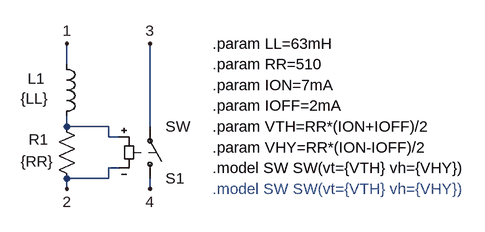
[diagram p0: schematic relais.asc]
relais.asc, the LTspice schematic file:
Version 4
SHEET 1 880 680
WIRE 176 80 176 48
WIRE 176 176 176 160
WIRE 240 176 176 176
WIRE 304 176 304 48
WIRE 240 192 240 176
WIRE 256 192 240 192
WIRE 256 240 240 240
WIRE 240 256 240 240
WIRE 240 256 176 256
WIRE 176 272 176 256
WIRE 304 272 304 256
FLAG 176 48 1
FLAG 176 272 2
FLAG 304 48 3
FLAG 304 272 4
SYMBOL ind 160 64 R0
WINDOW 0 -44 38 Left 2
WINDOW 3 -55 69 Left 2
SYMATTR InstName L1
SYMATTR Value {LL}
SYMATTR SpiceLine Ipk=20m Rser=0 Rpar=100Meg Cpar=0
SYMBOL res 160 160 R0
WINDOW 0 -43 36 Left 2
WINDOW 3 -55 70 Left 2
SYMATTR InstName R1
SYMATTR Value {RR}
SYMBOL sw 304 272 M180
SYMATTR InstName S1
TEXT 400 48 Left 2 !.param LL=63mH
TEXT 400 80 Left 2 !.param RR=510
TEXT 400 112 Left 2 !.param ION=7mA\n.param IOFF=2mA
TEXT 400 176 Left 2 !.param VTH=RR*(ION+IOFF)/2
TEXT 400 208 Left 2 !.param VHY=RR*(ION-IOFF)/2
TEXT 400 272 Left 2 ;.model SW SW(vt={VTH} vh={VHY})
TEXT 400 240 Left 2 !.model SW SW(vt={VTH} vh={VHY})

The netlist it stands for:
* relais.asc
L1 1 N001 {LL} Ipk=20m Rser=0 Rpar=100Meg Cpar=0
R1 N001 2 {RR}
S1 4 3 N001 2 SW
.param LL=63mH
.param RR=510
.param ION=7mA
.param IOFF=2mA
.param VTH=RR*(ION+IOFF)/2
.param VHY=RR*(ION-IOFF)/2
* .model SW SW(vt={VTH} vh={VHY})
.model SW SW(vt={VTH} vh={VHY})
.backanno
.end